# EasyEDA Pro project 16316339.epro, schematic 15F_SCH

## Sheets
1 MOT: Board Name: 15F1D_EDA; Create Date: 2024-05-13; Page Name: MOT; Project Name: 15F1D_EDA; Schematic Name: 15F_SCH; Update Date: 2024-05-16
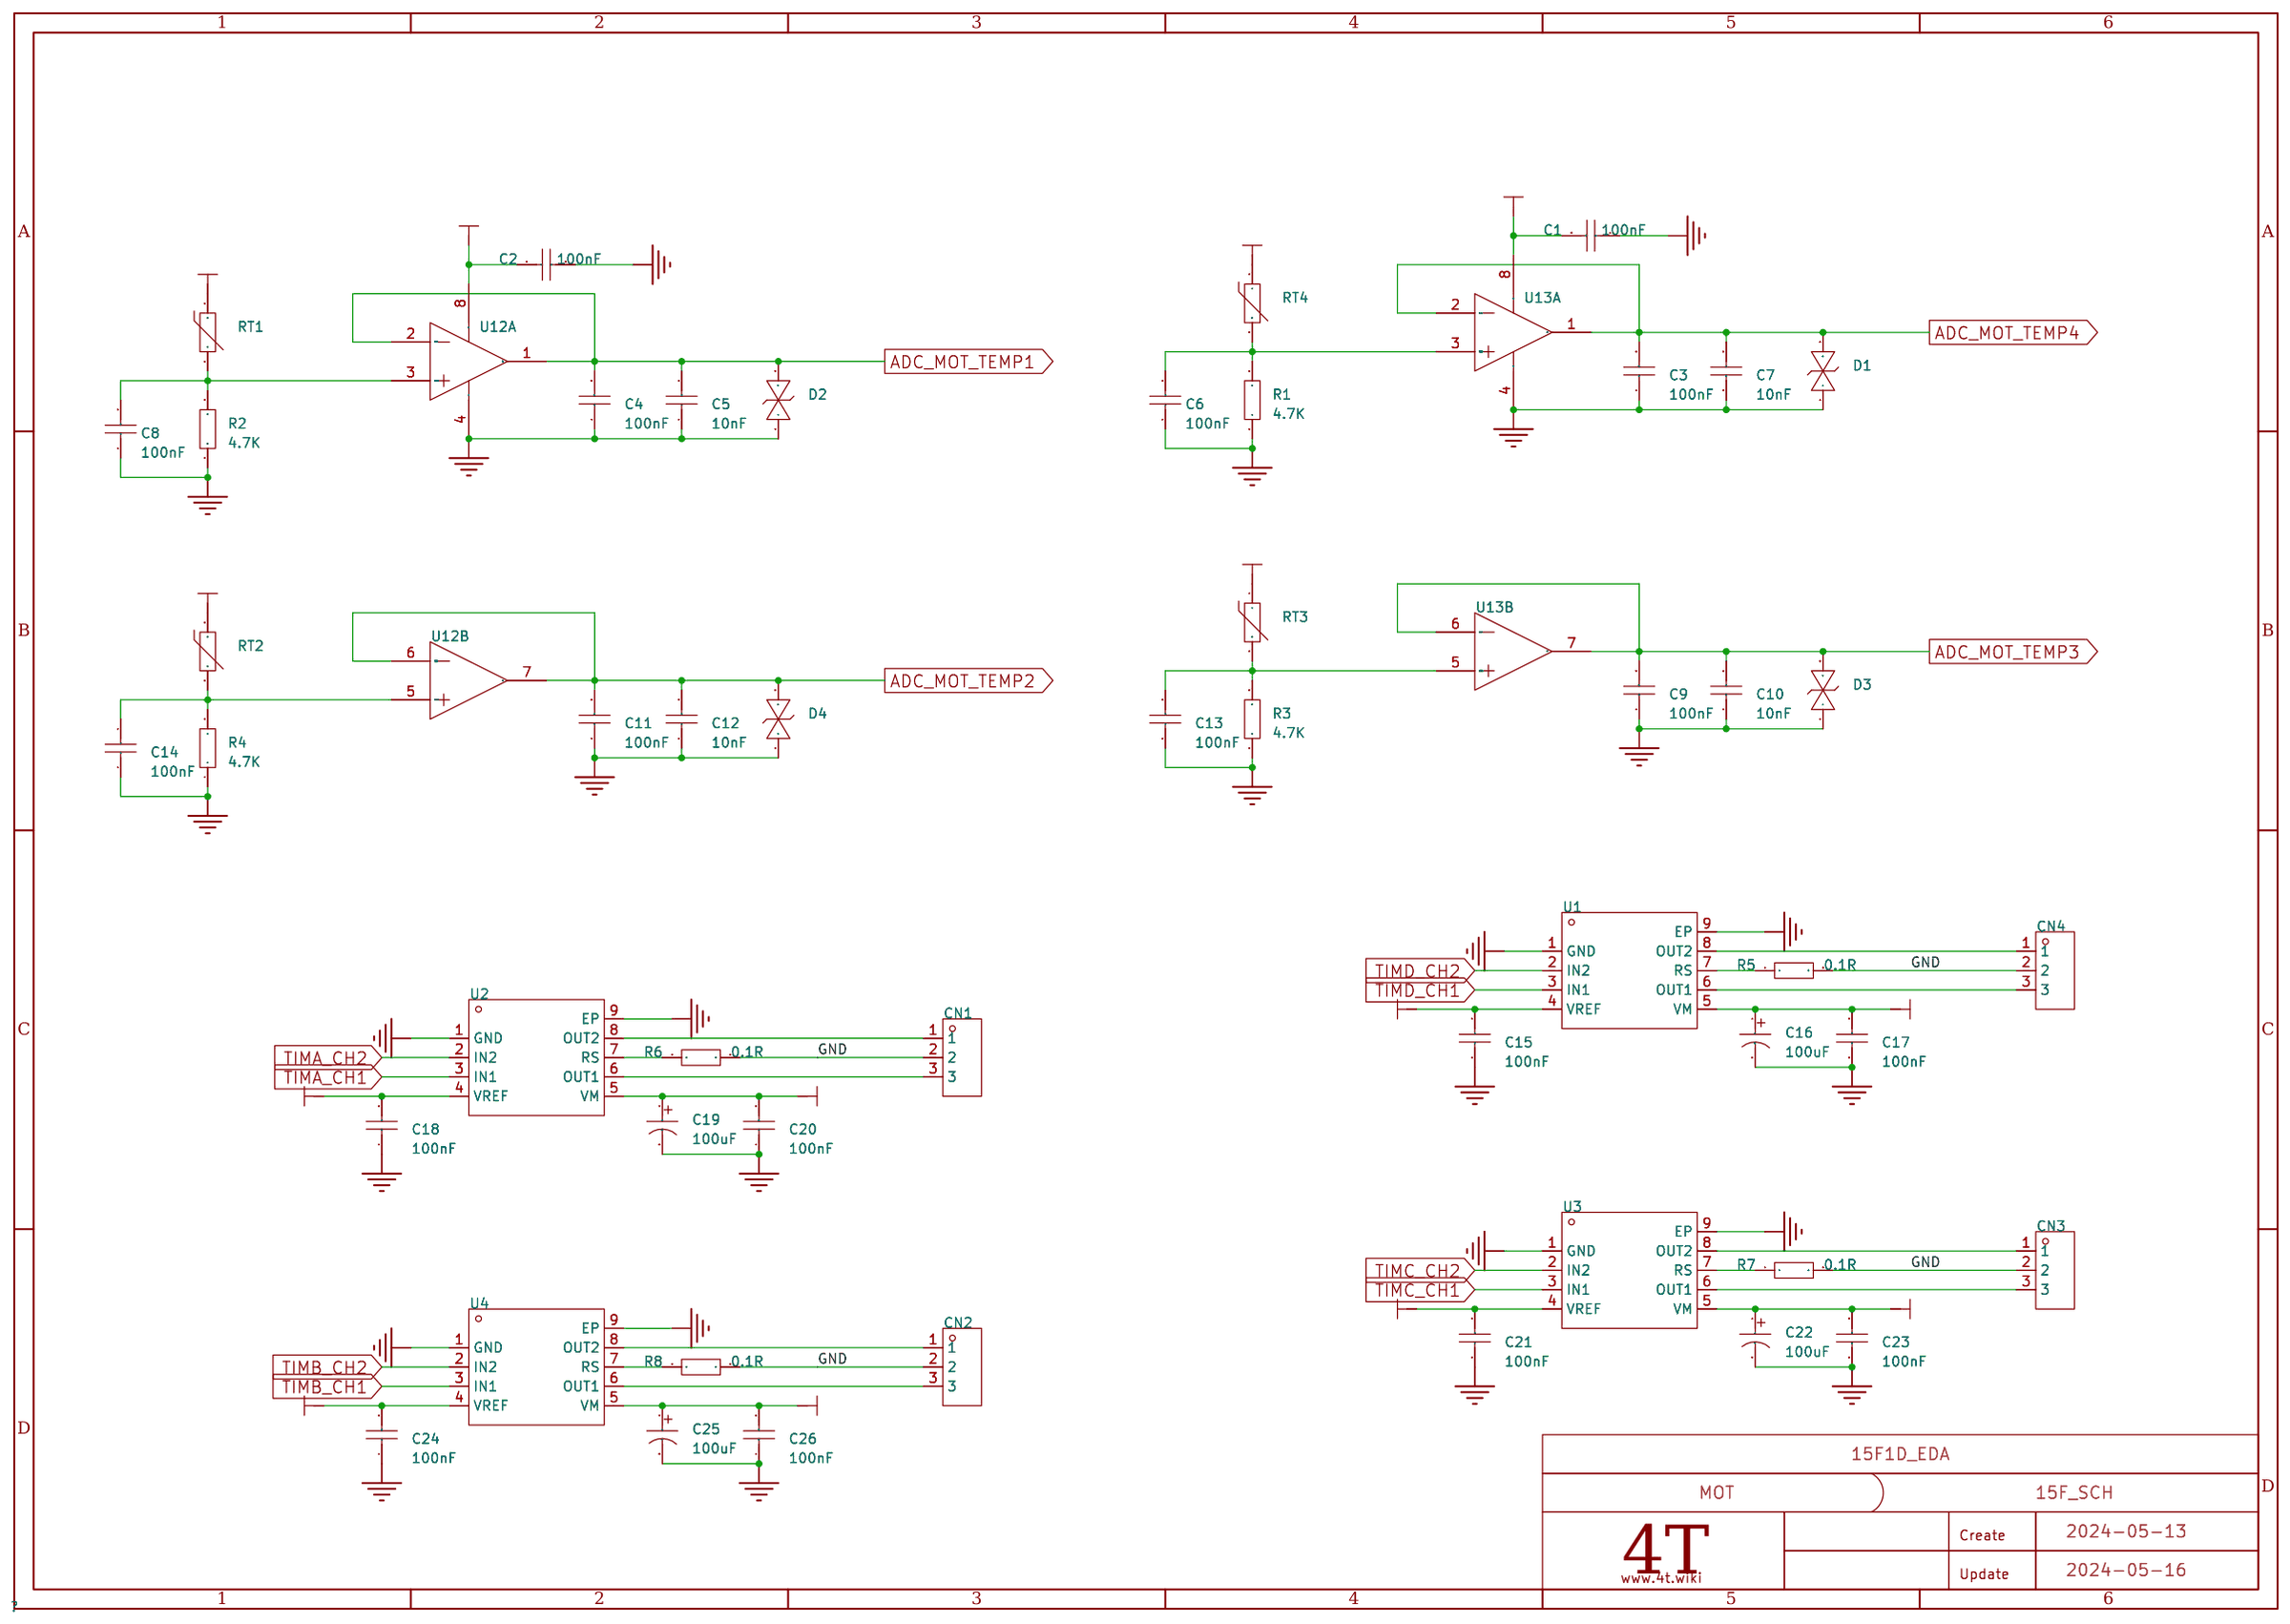
[diagram p0: MOT]
2 COM: Page Name: COM
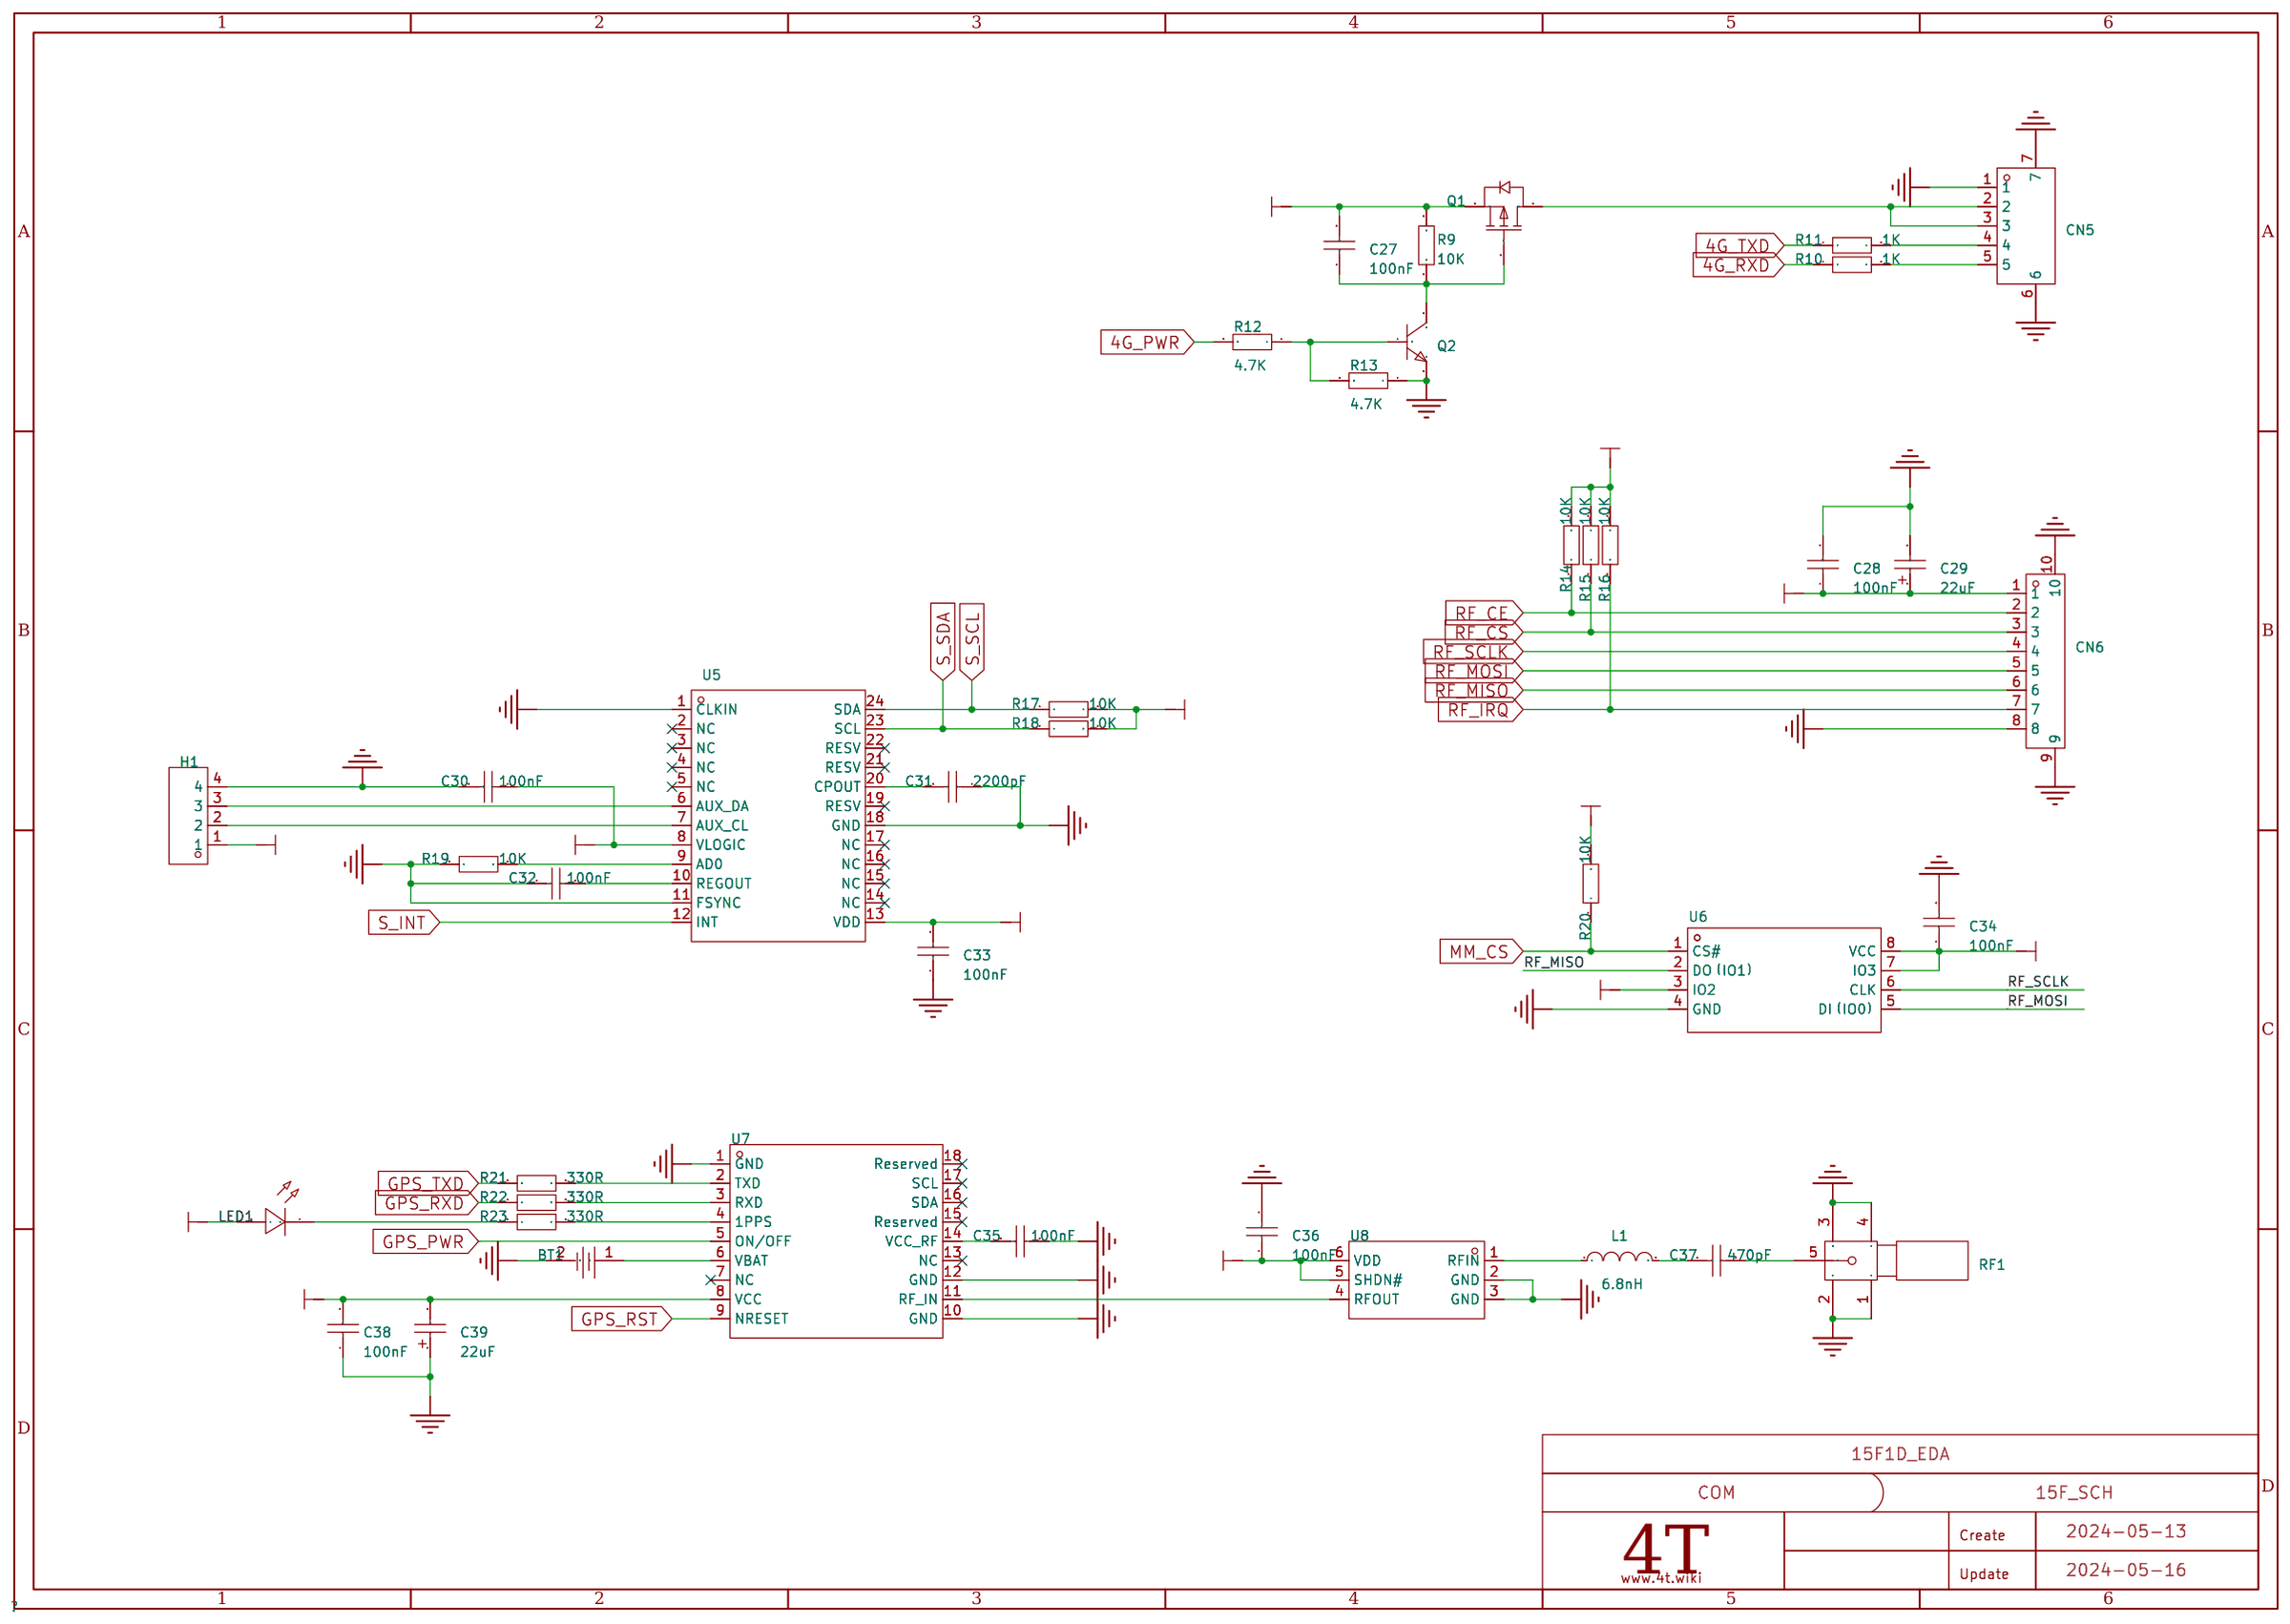
[diagram p1: COM]
3 PWR: Page Name: PWR
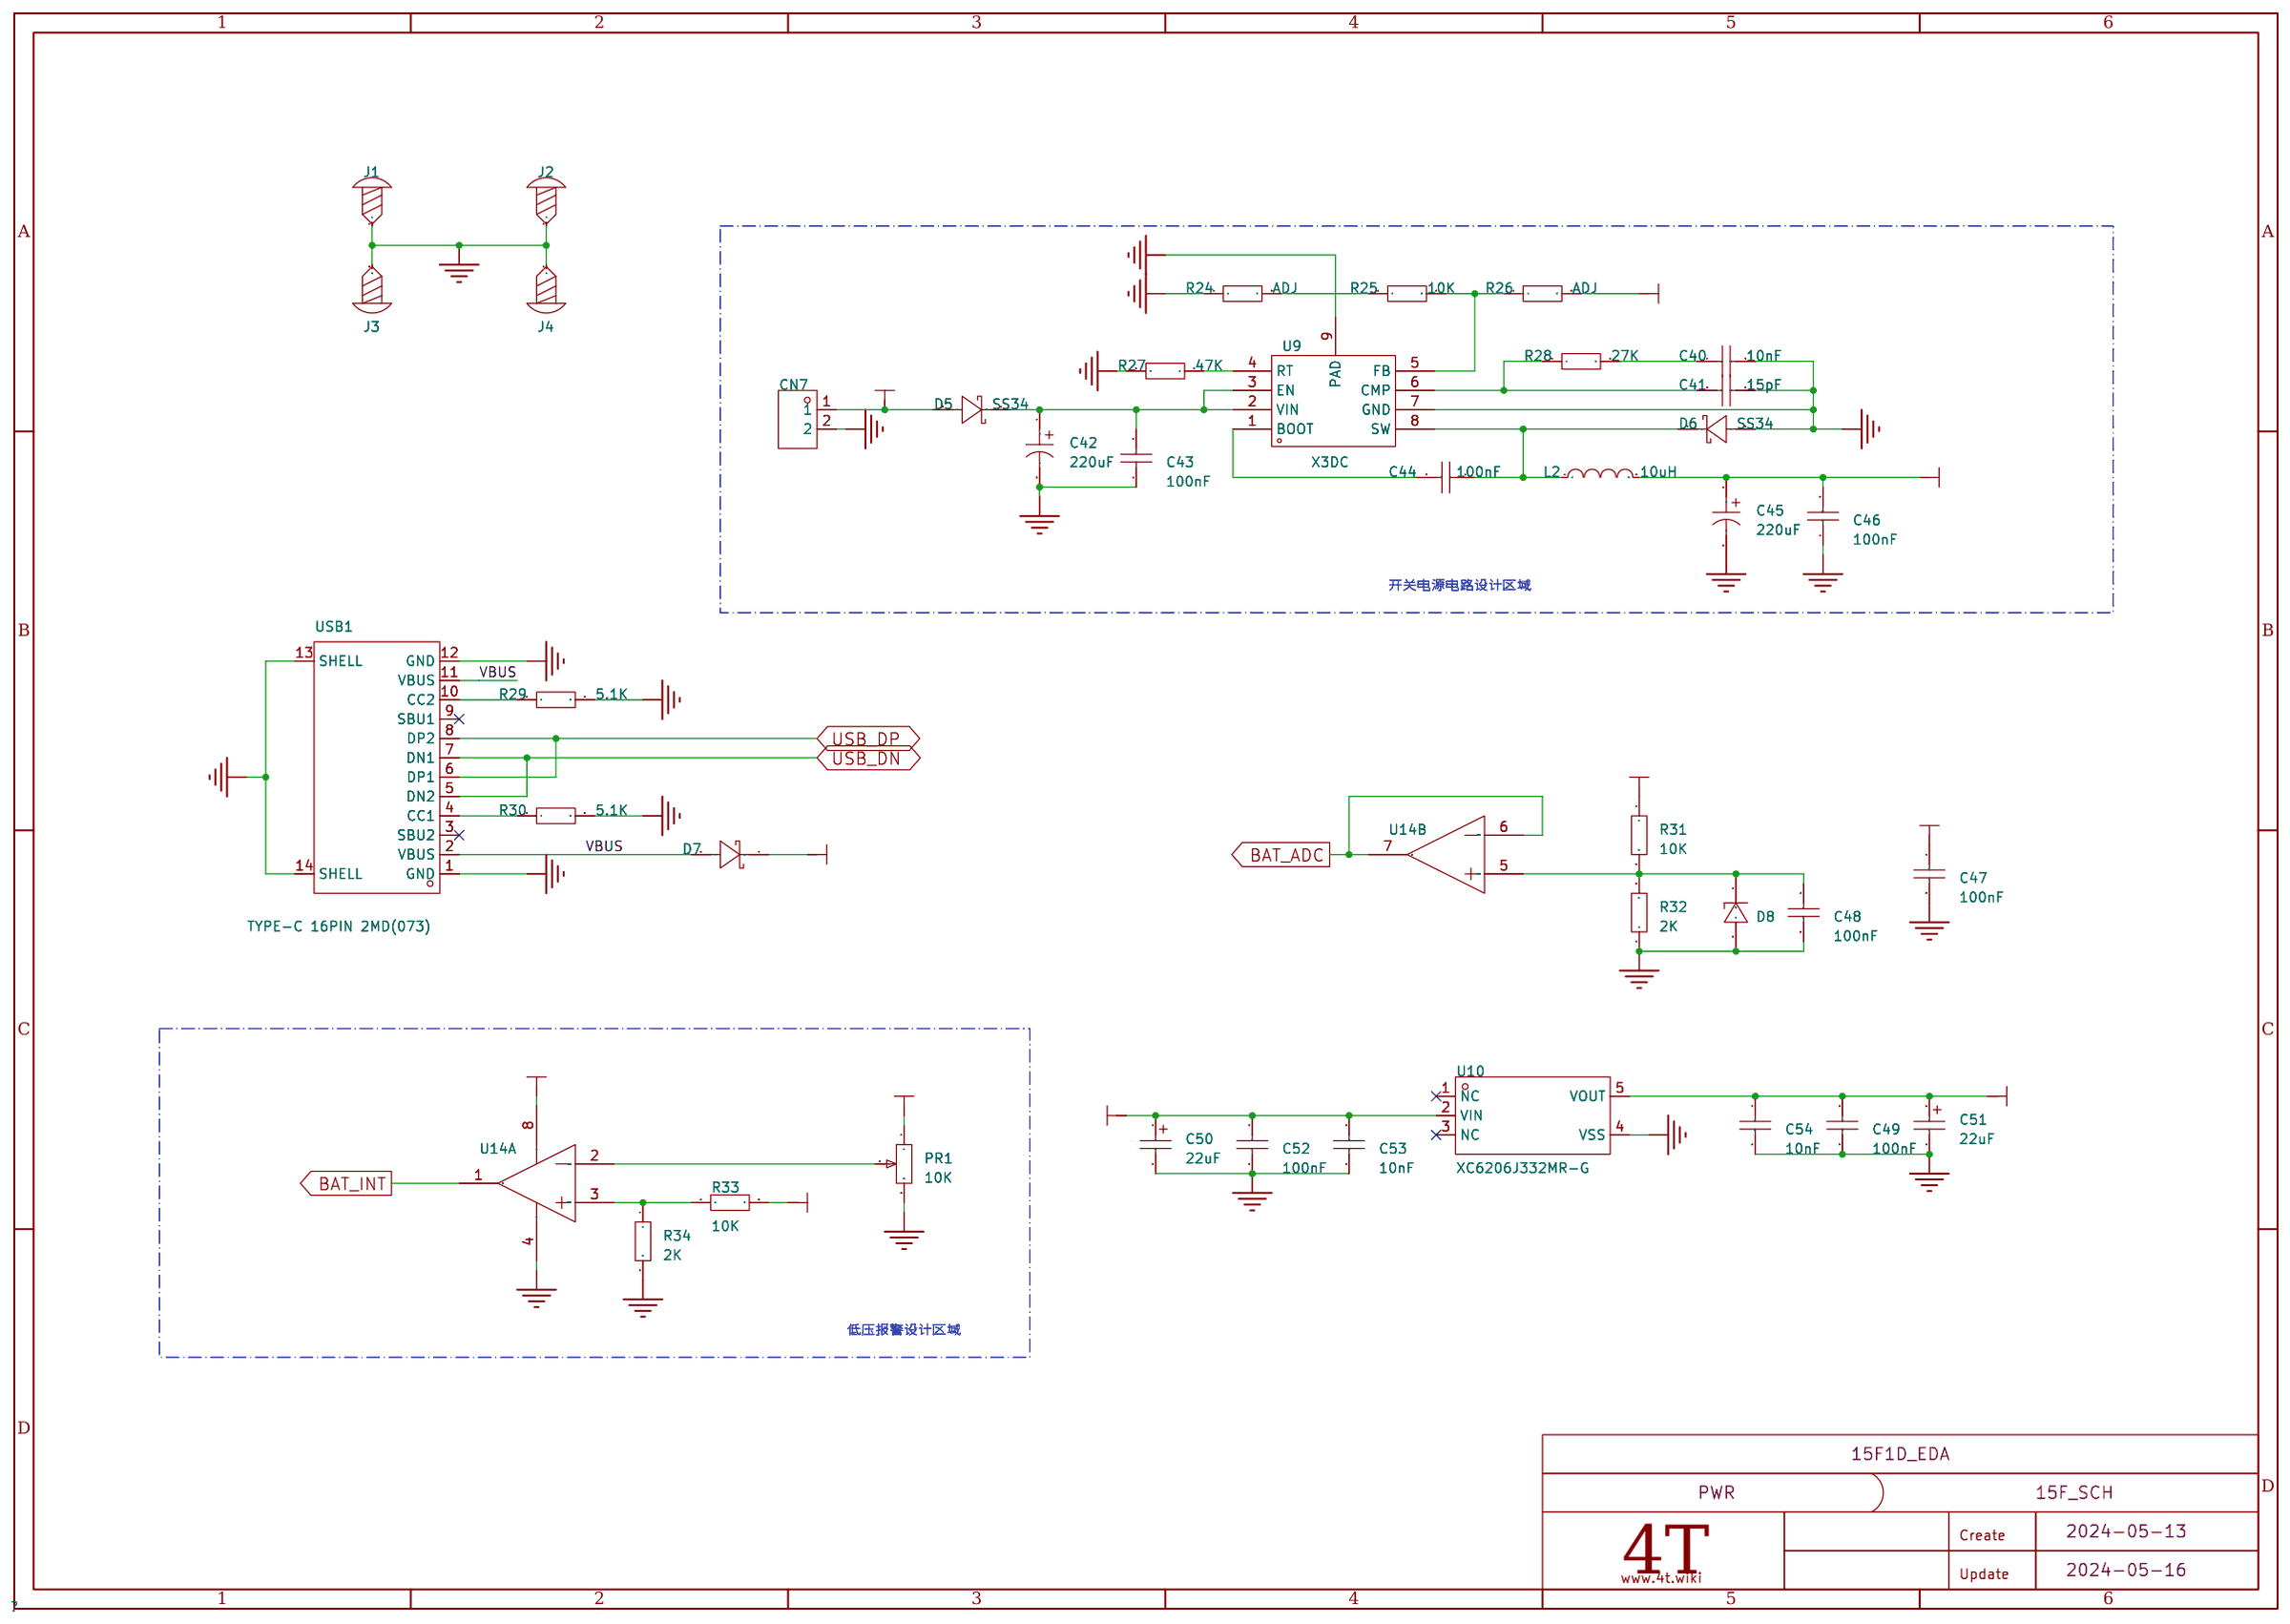
[diagram p2: PWR]
4 MCU: Page Name: MCU
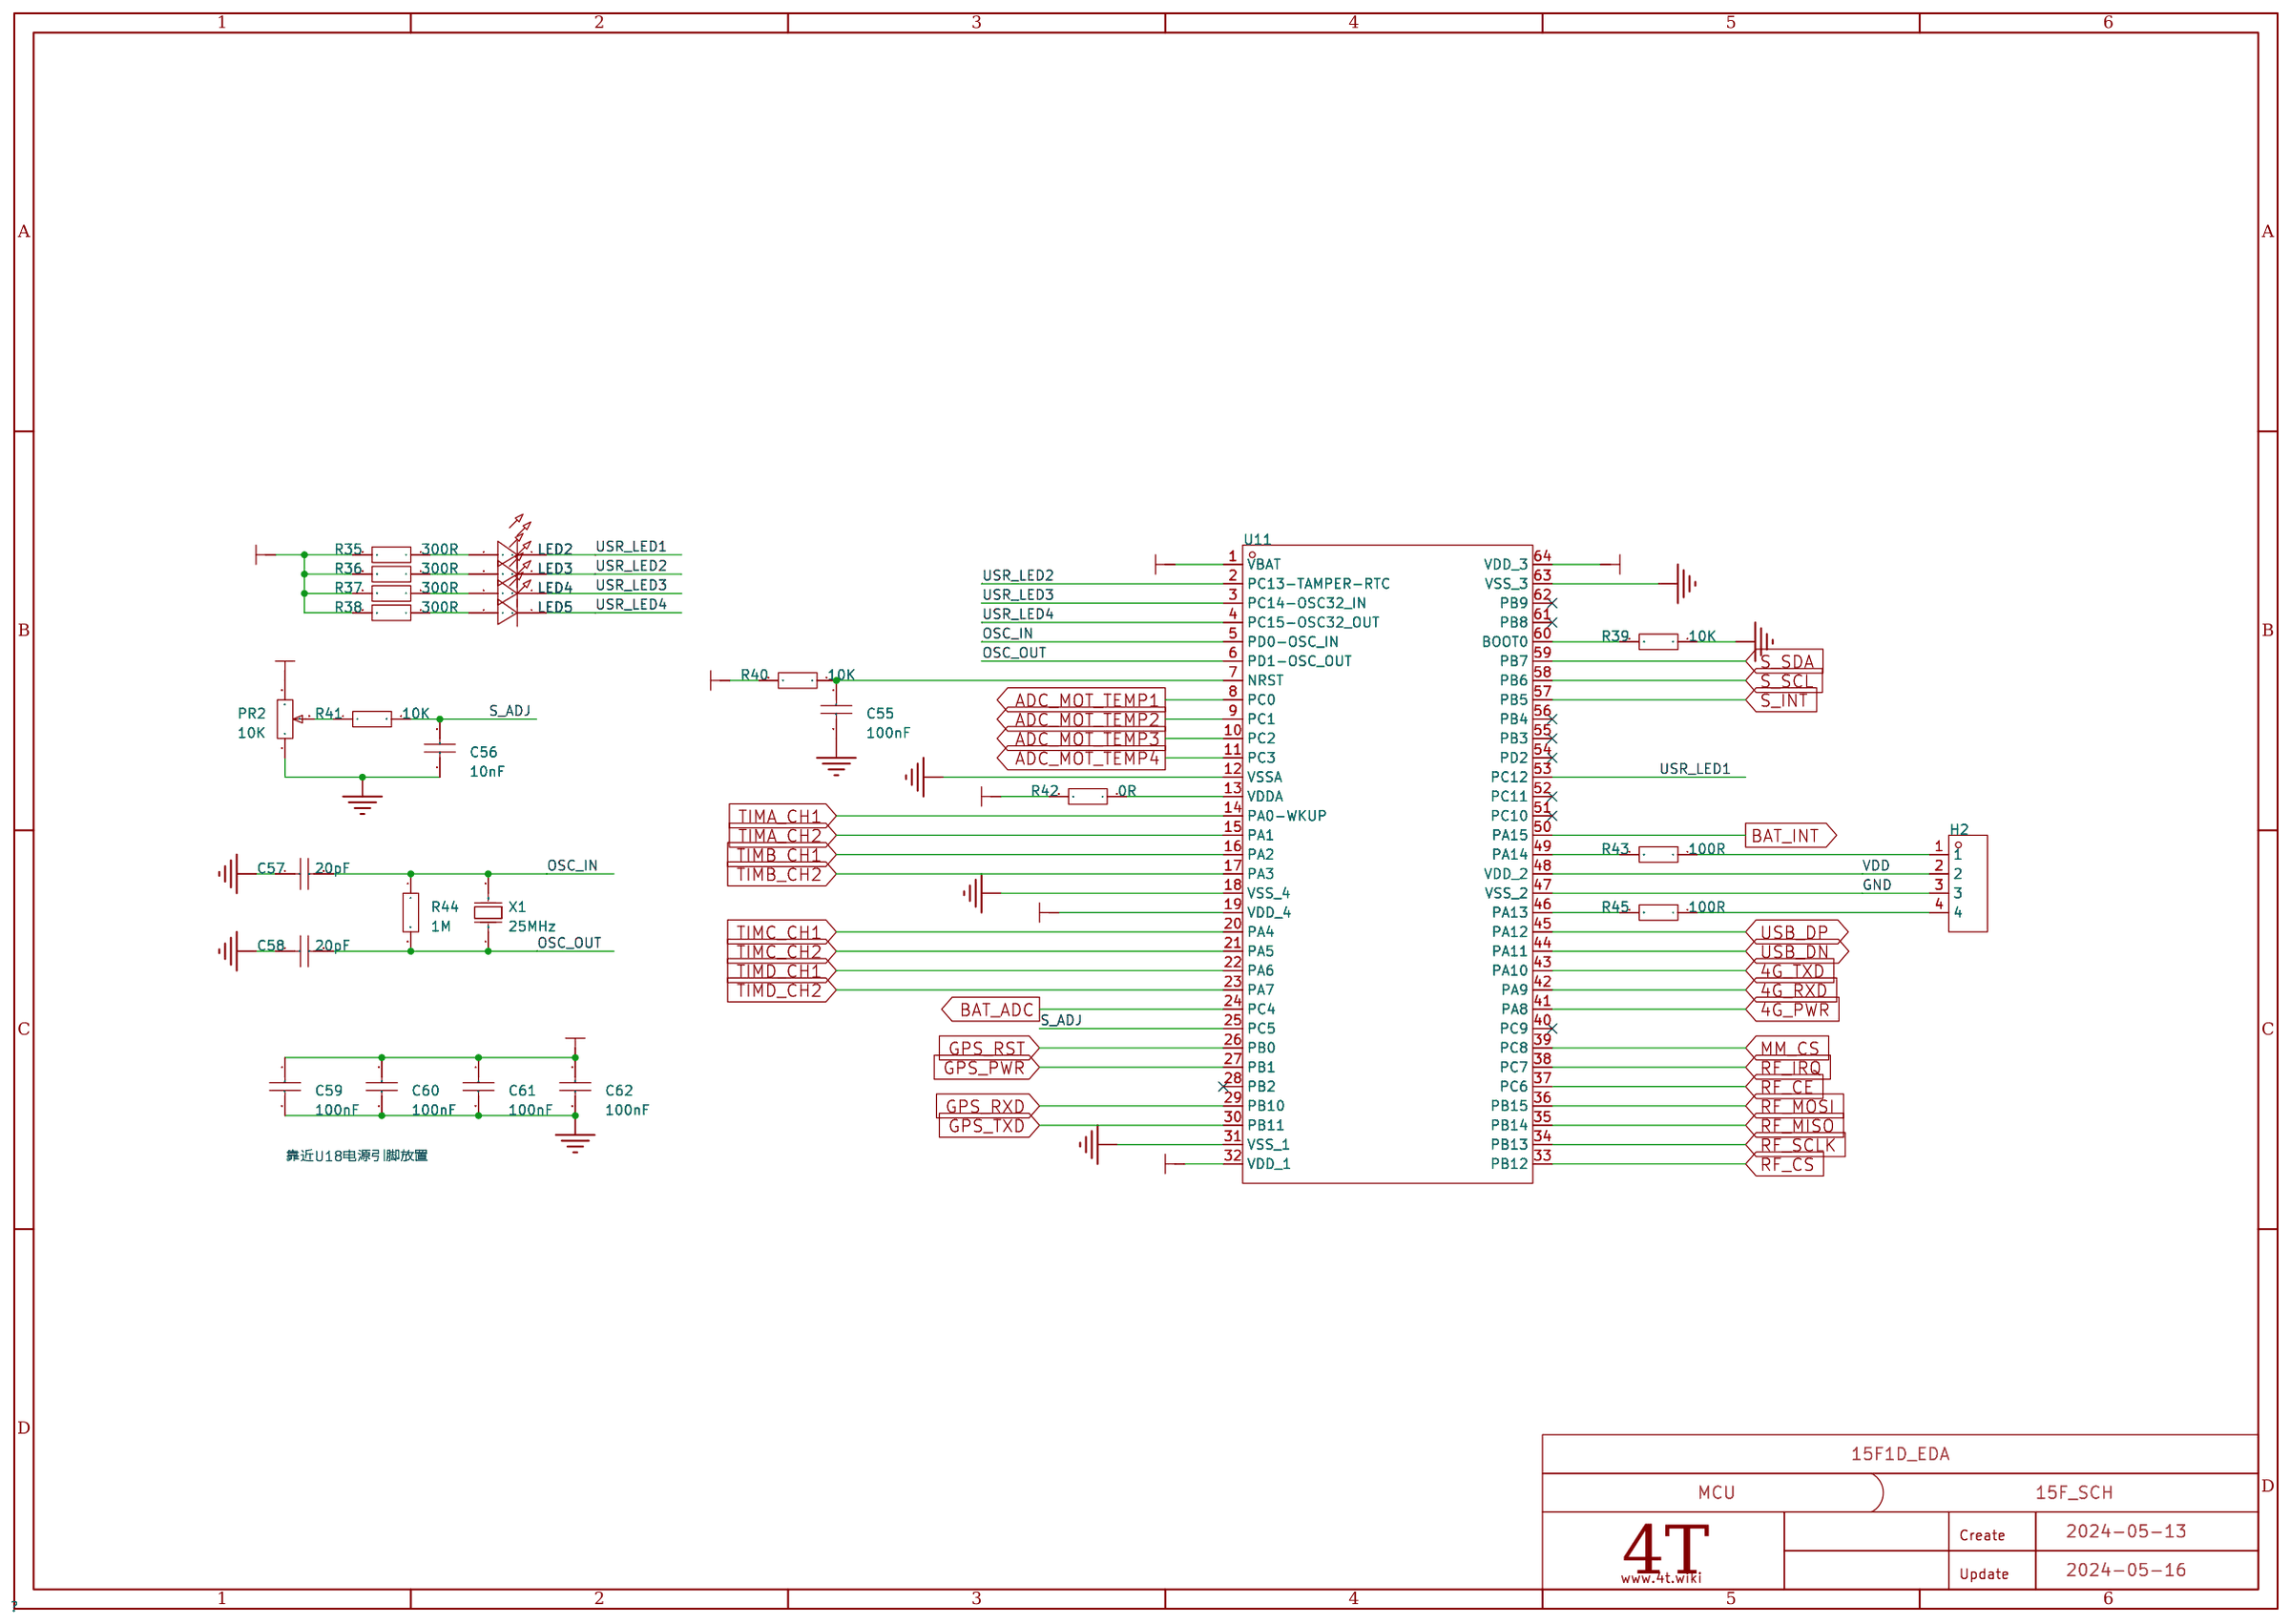
[diagram p3: MCU]

## Parts
sheet COM
BT1  CR1220-A  [BAT-SMD_CR1220-2]
C27  100nF  [C0805]
C28  100nF  [C0805]
C29  22uF  [CASE-A_3216]
C30  100nF  [C0805]
C31  2200pF  [C0805]
C32  100nF  [C0805]
C33  100nF  [C0805]
C34  100nF  [C0805]
C35  100nF  [C0805]
C36  100nF  [C0805]
C37  470pF  [C0805]
C38  100nF  [C0805]
C39  22uF  [CASE-A_3216]
CN5  ZX-XH2.54-5PWT  [CONN-SMD_5P-P2.54_MEGASTAR_ZX-XH2.54-5PWT]
CN6  2.54-8P WT  [CONN-SMD_8P-P2.50_2.54-8P-WT]
H1  -  [HDR-TH_4P-P2.54-V-F]
L1  6.8nH  [L0805]
LED1  -  [LED_0805]
Q1  AO3401A  [SOT-23_L2.9-W1.3-P1.90-LS2.4-BR]
Q2  S8050 J3Y  [SOT-23-3_L3.0-W1.7-P0.95-LS2.9-BR]
R9  10K  [R0805]
R10  1K  [R0805]
R11  1K  [R0805]
R12  4.7K  [R0805]
R13  4.7K  [R0805]
R14  10K  [R0805]
R15  10K  [R0805]
R16  10K  [R0805]
R17  10K  [R0805]
R18  10K  [R0805]
R19  10K  [R0805]
R20  10K  [R0805]
R21  330R  [R0805]
R22  330R  [R0805]
R23  330R  [R0805]
RF1  BWSMA-KWE-Z001  [SMA-TH_BWSMA-KWE-Z001]
U5  MPU6050  [QFN-24_L4.0-W4.0-P0.50-BL]
U6  W25Q32JVSSIQ  [SOIC-8_L5.3-W5.3-P1.27-LS8.0-BL]
U7  ATGM336H-5N31  [GPSM-SMD_ATGM336H-TR]
U8  AT2659S  [SOT-23-6_L2.9-W1.6-P0.95-LS2.8-BR]
sheet MCU
C55  100nF  [C0805]
C56  10nF  [C0805]
C57  20pF  [C0805]
C58  20pF  [C0805]
C59  100nF  [C0805]
C60  100nF  [C0805]
C61  100nF  [C0805]
C62  100nF  [C0805]
H2  -  [HDR-TH_4P-P2.54-V-M]
LED2  -  [LED_0603]
LED3  -  [LED_0603]
LED4  -  [LED_0603]
LED5  -  [LED_0603]
PR2  10K  [R_3386P]
R35  300R  [R0805]
R36  300R  [R0805]
R37  300R  [R0805]
R38  300R  [R0805]
R39  10K  [R0805]
R40  10K  [R0805]
R41  10K  [R0805]
R42  0R  [R0805]
R43  100R  [R0805]
R44  1M  [R0805]
R45  100R  [R0805]
U11  GD32F307RCT6  [LQFP-64_L10.0-W10.0-P0.50-LS12.0-BL]
X1  25MHz  [HC-49S_L11.4-W4.8]
sheet MOT
C1  100nF  [C0805]
C2  100nF  [C0805]
C3  100nF  [C0805]
C4  100nF  [C0805]
C5  10nF  [C0805]
C6  100nF  [C0805]
C7  10nF  [C0805]
C8  100nF  [C0805]
C9  100nF  [C0805]
C10  10nF  [C0805]
C11  100nF  [C0805]
C12  10nF  [C0805]
C13  100nF  [C0805]
C14  100nF  [C0805]
C15  100nF  [C0805]
C16  100uF  [CAP-SMD_BD6.3-L6.6-W6.6-LS7.2-FD]
C17  100nF  [C0805]
C18  100nF  [C0805]
C19  100uF  [CAP-SMD_BD6.3-L6.6-W6.6-LS7.2-FD]
C20  100nF  [C0805]
C21  100nF  [C0805]
C22  100uF  [CAP-SMD_BD6.3-L6.6-W6.6-LS7.2-FD]
C23  100nF  [C0805]
C24  100nF  [C0805]
C25  100uF  [CAP-SMD_BD6.3-L6.6-W6.6-LS7.2-FD]
C26  100nF  [C0805]
CN1  2.54-1*3P  [CONN-TH_C722693]
CN2  2.54-1*3P  [CONN-TH_C722693]
CN3  2.54-1*3P  [CONN-TH_C722693]
CN4  2.54-1*3P  [CONN-TH_C722693]
D1  H3V3LD5B  [SOD-523F_L1.7-W0.9-LS1.7-BI]
D2  H3V3LD5B  [SOD-523F_L1.7-W0.9-LS1.7-BI]
D3  H3V3LD5B  [SOD-523F_L1.7-W0.9-LS1.7-BI]
D4  H3V3LD5B  [SOD-523F_L1.7-W0.9-LS1.7-BI]
R1  4.7K  [R0805]
R2  4.7K  [R0805]
R3  4.7K  [R0805]
R4  4.7K  [R0805]
R5  0.1R  [R0805]
R6  0.1R  [R0805]
R7  0.1R  [R0805]
R8  0.1R  [R0805]
RT1  NTC 5D-7  [RES-TH_L8.5-W5.5-P5.00-D0.6-S5.50]
RT2  NTC 5D-7  [RES-TH_L8.5-W5.5-P5.00-D0.6-S5.50]
RT3  NTC 5D-7  [RES-TH_L8.5-W5.5-P5.00-D0.6-S5.50]
RT4  NTC 5D-7  [RES-TH_L8.5-W5.5-P5.00-D0.6-S5.50]
U1  TB67H450FNG,EL  [HSOP-8_L5.0-W4.0-P1.27-LS6.2-BL-EP]
U2  TB67H450FNG,EL  [HSOP-8_L5.0-W4.0-P1.27-LS6.2-BL-EP]
U3  TB67H450FNG,EL  [HSOP-8_L5.0-W4.0-P1.27-LS6.2-BL-EP]
U4  TB67H450FNG,EL  [HSOP-8_L5.0-W4.0-P1.27-LS6.2-BL-EP]
U12  GS8552-SR  [SOIC-8_L4.9-W3.9-P1.27-LS6.0-BL]  (sections 1,2)
U13  GS8552-SR  [SOIC-8_L4.9-W3.9-P1.27-LS6.0-BL]  (sections 1,2)
sheet PWR
C40  10nF  [C0805]
C41  15pF  [C0805]
C42  220uF  [CAP-SMD_BD8.0-L8.3-W8.3-LS9.3-FD]
C43  100nF  [C0805]
C44  100nF  [C0805]
C45  220uF  [CAP-SMD_BD8.0-L8.3-W8.3-LS9.3-FD]
C46  100nF  [C0805]
C47  100nF  [C0805]
C48  100nF  [C0805]
C49  100nF  [C0805]
C50  22uF  [CASE-A_3216]
C51  22uF  [CASE-A_3216]
C52  100nF  [C0805]
C53  10nF  [C0805]
C54  10nF  [C0805]
CN7  ZX-XH2.54-2PZZ  [CONN-TH_2P-P2.50_HX25003-2A]
D5  SS34  [SMA_L4.3-W2.5-LS5.0-RD]
D6  SS34  [SMA_L4.3-W2.5-LS5.0-RD]
D7  SS34  [SMA_L4.3-W2.5-LS5.0-RD]
D8  BZT52C3V3S  [SOD-323_L1.8-W1.3-LS2.5-RD]
J1  -  [M2螺丝]
J2  -  [M2螺丝]
J3  -  [M2螺丝]
J4  -  [M2螺丝]
L2  10uH  [IND-SMD_L7.3-W6.8]
PR1  10K  [R_3386P]
R24  ADJ  [R0805]
R25  10K  [R0805]
R26  ADJ  [R0805]
R27  47K  [R0805]
R28  27K  [R0805]
R29  5.1K  [R0805]
R30  5.1K  [R0805]
R31  10K  [R0805]
R32  2K  [R0805]
R33  10K  [R0805]
R34  2K  [R0805]
U9  X3DC  [QN_X3DC]
U10  XC6206J332MR-G  [SOT-25_L3.0-W1.6-P0.95-LS2.8-BR]
U14  GS8552-SR  [SOIC-8_L4.9-W3.9-P1.27-LS6.0-BL]  (sections 1,2)
USB1  TYPE-C 16PIN 2MD(073)  [USB-C-SMD_TYPE-C-6PIN-2MD-073]

## Library data of the parts
BT1 = CR1220-A: Supplier Part: C9900016718; Supplier Footprint: SMD-2P; JLCPCB Part Class: 扩展库; Supplier: LCSC
C1-C15 C17 C18 C20 C21 C23 C24 C26-C28 C30-C38 C40 C41 C43 C44 C46-C49 C52-C62 = CC0805KKX7R0BB104: 容值:100nF;精度:±10%;额定电压:100V;材质(温度系数):X7R;; LCSC Part Name: 100nF ±10% 100V; Supplier Part: C106243; Manufacturer: YAGEO(国巨); Supplier Footprint: 0805; Datasheet: https://atta.szlcsc.com/upload/public/pdf/source/20170505/1493951378248.pdf; Supplier: LCSC; Tolerance: ±10%; Voltage Rated: 100V; Temperature Coefficient: X7R
C29 C39 C50 C51 = TAJA226K010RNJ: 容值:22uF;精度:±10%;额定电压:10V;等效串联电阻:3Ω@100kHz;; LCSC Part Name: 22uF ±10% 10V; Supplier Part: C11366; Manufacturer: Kyocera AVX; Supplier Footprint: CASE-A-3216; JLCPCB Part Class: 扩展库; Datasheet: https://atta.szlcsc.com/upload/public/pdf/source/20160107/1457707750344.pdf; Supplier: LCSC; Tolerance: ±10%; Rated Voltage: 10V; Equivalent Series Resistance(ESR): 3Ω@100kHz; Operating Temperature: -55℃~+125℃
CN5 = ZX-XH2.54-5PWT: 插针结构:1x5P;间距:2.54mm;安装方式:卧贴;参考系列:XH;总PIN数:5P;排数:1;每排PIN数:5;行距:-;额定电流:3A;触头材质:黄铜;触头镀层:锡;工作温度范围:-25℃~+85℃;; Supplier Part: C7429674; Manufacturer: Megastar(兆星); Supplier Footprint: SMD,P=2.54mm,卧贴; JLCPCB Part Class: 扩展库; Datasheet: https://atta.szlcsc.com/upload/public/pdf/source/20230619/A4241001BDA461A644BDF6B504C3AF76.pdf; Supplier: LCSC; Pins Structure: 1x5P; Pitch: 2.54mm; Mounting Style: 卧贴; Reference Series: XH; Number of Pins: 5P; Number of Rows: 1; Number of PINs Per Row: 5; Current Rating (Max): 3A; Contact Material: 黄铜; Contact Plating: 锡; Operating Temperature Range: -25℃~+85℃
CN6 = 2.54-8P WT: 插针结构:1x8P;间距:2.54mm;安装方式:卧贴;参考系列:XH;总PIN数:8P;排数:1;每排PIN数:8;额定电流:3A;工作温度范围:-25℃~+85℃;; LCSC Part Name: 间距:2.54mm 1x8P 卧贴; Supplier Part: C5340837; Manufacturer: SHOU HAN(首韩); Supplier Footprint: SMD,P=2.54mm,卧贴; JLCPCB Part Class: 扩展库; Datasheet: https://atta.szlcsc.com/upload/public/pdf/source/20221228/85106BCD9EB86FC8546715D8BC1746BA.pdf; Supplier: LCSC; Pins Structure: 1x8P; Pitch: 2.54mm; Mounting Style: 卧贴; Reference Series: XH; Number of Pins: 8P; Number of Rows: 1; Number of PINs Per Row: 8; Current Rating (Max): 3A; Operating Temperature Range: -25℃~+85℃
H1 = HDR-F_2.54_1x4P: Supplier Part: C2718488; Supplier Footprint: 插件
L1 = BKW0805UC6N8JGT: 电感值:6.8nH;精度:±5%;额定电流:600mA;饱和电流(Isat):-;直流电阻(DCR):110mΩ;; LCSC Part Name: 6.8nH ±5%; Supplier Part: C98541; Manufacturer: FH-BK(风华邦科); Supplier Footprint: 0805; JLCPCB Part Class: 扩展库; Datasheet: https://atta.szlcsc.com/upload/public/pdf/source/20190320/C361661_D11C236CE6FE3C11C97B22D047CD9561.pdf; Supplier: LCSC; Tolerance: ±5%; Rated Current: 600mA; DC Resistance (DCR): 110mΩ
LED1 = LED_0805-G: Supplier Footprint: 0805
Q1 = AO3401A_C15127: 类型:1个P沟道;漏源电压(Vdss):30V;连续漏极电流(Id):4A;功率(Pd):1.4W;导通电阻(RDS(on)@Vgs,Id):44mΩ@10V,4.3A;阈值电压(Vgs(th)@Id):1.3V@250uA;; LCSC Part Name: 1个P沟道 耐压:30V 电流:4A; Supplier Part: C15127; Manufacturer: AOS; Supplier Footprint: SOT-23; JLCPCB Part Class: 基础库; Datasheet: https://atta.szlcsc.com/upload/public/pdf/source/20160507/1462613609053.pdf; Supplier: LCSC; Type: 1个P沟道; Drain Source Voltage (Vdss): 30V; Continuous Drain Current (Id): 4A; Power Dissipation (Pd): 1.4W; Drain Source On Resistance (RDS(on)@Vgs,Id): 44mΩ@10V,4.3A; Gate Threshold Voltage (Vgs(th)@Id): 1.3V@250uA; Total Gate Charge (Qg@Vgs): 12.2nC@4.5V; Input Capacitance (Ciss@Vds): 1.2nF@15V; Operating Temperature: -55℃~+150℃@(Tj)
Q2 = S8050 J3Y_C2146: 晶体管类型:NPN;集电极电流(Ic):500mA;集射极击穿电压(Vceo):25V;功率(Pd):300mW;直流电流增益(hFE@Ic,Vce):200@50mA,1V;; LCSC Part Name: S8050 J3Y(RANGE:200-350) H档(200-350); Supplier Part: C2146; Manufacturer: CJ(江苏长电/长晶); Supplier Footprint: SOT-23; JLCPCB Part Class: 基础库; Datasheet: https://atta.szlcsc.com/upload/public/pdf/source/20140809/1457707209234.pdf; Supplier: LCSC; Transistor Type: NPN; Collector Current (Ic): 500mA; Collector-Emitter Breakdown Voltage (Vceo): 25V; Power Dissipation (Pd): 300mW; DC Current Gain (hFE@Ic,Vce): 200@50mA,1V; Transition Frequency (fT): 150MHz; Collector Cut-Off Current (Icbo): 100nA; Collector-Emitter Saturation Voltage (VCE(sat)@Ic,Ib): 600mV@500mA,50mA
R1-R45 = Res_0805: Supplier Footprint: 0805
RF1 = BWSMA-KWE-Z001: 连接器类型:板端;接口类型:内孔;端口数量:1;接口直径:5.3mm;接口长度/高度:-;频率-最大值:-;射频系列:SMA;阻抗:50Ω;样式:弯头;触头材质:-;触头镀层:-;工作温度范围:-;焊接温度(最大值):-;; LCSC Part Name: 内孔 SMA 弯头; Supplier Part: C496551; Manufacturer: BAT WIRELESS(蝙蝠无线); Supplier Footprint: 插件; JLCPCB Part Class: 扩展库; Datasheet: https://atta.szlcsc.com/upload/public/pdf/source/20231017/997A8C2ADA7F8034A89BE1264F38CE52.pdf; Supplier: LCSC; Connector Type: 板端; Interface Type: 内孔; Number of Ports: 1; Interface Diameter: 5.3mm; RF Series: SMA; Impedance: 50Ω; Style: 弯头
U5 = MPU6050: Supplier Part: C9900042518; Supplier Footprint: QFN-24_L4.0-W4.0-P0.50-BL-EP2.7; Supplier: LCSC
U6 = W25Q32JVSSIQ_C82344: 接口类型:SPI;存储容量:32Mbit;; Supplier Part: C82344; Manufacturer: WINBOND(华邦); Supplier Footprint: SOIC-8-208mil; JLCPCB Part Class: 扩展库; Datasheet: https://atta.szlcsc.com/upload/public/pdf/source/20160910/1473490310454.pdf; Supplier: LCSC; Interface Type: SPI; Memory Size: 32Mbit; Supply Voltage: 2.7V~3.6V; Page Programming Time (Tpp): 3ms; Operating Temperature: -40℃~+85℃
U7 = ATGM336H-5N31: 卫星定位模块 GPS+BDS; LCSC Part Name: BDS/GNSS 全星座定位导航模块; Supplier Part: C90770; Manufacturer: 杭州中科微; Supplier Footprint: SMD,9.7x10.1mm; JLCPCB Part Class: 扩展库; Datasheet: https://atta.szlcsc.com/upload/public/pdf/source/20161226/1482720799860.pdf; Supplier: LCSC
U8 = AT2659S: 电源电压:1.4V~3.6V;供电电流:4.4mA;增益:20dB;P1dB:-15dBm;噪声系数:0.8dB;; LCSC Part Name: L1频段卫星导航射频前端低噪声放大器芯片; Supplier Part: C883443; Manufacturer: 杭州中科微; Supplier Footprint: SOT-23-6; JLCPCB Part Class: 扩展库; Datasheet: https://atta.szlcsc.com/upload/public/pdf/source/20210918/7991F10054B7CD619D693C120CAE9FC9.pdf; Supplier: LCSC; Supply Voltage: 1.4V~3.6V; Supply Current: 4.4mA; Gain: 20dB; P1dB: -15dBm; Noise Figure: 0.8dB; Operating Temperature: -40℃~+85℃
H2 = HDR-M_2.54_1x4P: Supplier Part: C492403; Supplier Footprint: 插件
LED2-LED5 = LED_0603-G: Supplier Footprint: 0603
PR1 PR2 = R_3386P: Supplier Footprint: 直插
U11 = GD32F307RCT6: CPU内核:CM4;程序存储容量:256KB;RAM总容量:96KB;GPIO端口数量:51;工作电压范围:-;CPU最大主频:120MHz;程序存储器类型:FLASH;; Supplier Part: C2959762; Manufacturer: GigaDevice(兆易创新); Supplier Footprint: LQFP-64(10x10); JLCPCB Part Class: 扩展库; Datasheet: https://atta.szlcsc.com/upload/public/pdf/source/20220330/9EB4CC969FC073C66EE3B7E220D59F89.pdf; Supplier: LCSC; CPU Core: CM4; Program Storage Size: 256KB; RAM Size: 96KB; GPIO Ports Number: 51; CPU Maximum Speed: 120MHz; Program Memory Type: FLASH; ADC (Bit): 12bit; DAC (Bit): 12bit; 16Bit Timer: 7; CAN: 2; UART/USART: 5; I2C: 2; I2S: 2; SPI: 3; Universal Serial Bus: 有; Peripheral/Function: 看门狗；以太网协议栈；RTC实时时钟; communication protocol: 以太网协议; Watchdog: 有; Real-Time Clock: 有; Internal Oscillator: 有
X1 = X49SM25MSD2SC: 晶振类型:贴片晶振;频率:25MHz;常温频差:±20ppm;外接负载电容:20pF;频率稳定度(全温):±30ppm;; LCSC Part Name: 25MHz ±20ppm 20pF; Supplier Part: C14872; Manufacturer: YXC(扬兴晶振); Supplier Footprint: HC-49S-SMD; JLCPCB Part Class: 扩展库; Datasheet: https://atta.szlcsc.com/upload/public/pdf/source/20240329/3EBF42EBCAB50CA65B6FA9D7CFA1955A.pdf; Supplier: LCSC; Crystal Type: 贴片晶振; Normal temperature Frequency Tolerance: ±20ppm; External load capacitor: 20pF; Frequency Stability(Full temperature range): ±30ppm; Operating Temperature: -20℃~+70℃
C16 C19 C22 C25 = RVT1C101M0605: 容值:100uF;精度:±20%;额定电压:16V;纹波电流:-;等效串联电阻:-;; LCSC Part Name: 100uF ±20% 16V; Supplier Part: C37308; Manufacturer: HONOR(荣誉); Supplier Footprint: SMD,D6.3xL5.4mm; JLCPCB Part Class: 扩展库; Datasheet: https://atta.szlcsc.com/upload/public/pdf/source/20210521/C113284_25C86AE95FB541053FE695F13EA8E7D0.pdf; Supplier: LCSC; Tolerance: ±20%; Rated Voltage: 16V; φD: 6.3mm; L: 5.4mm; Lifetime @ Temp: 2000hrs@105℃; Operating Temperature: -55℃~+105℃
CN1-CN4 = 2.54-1*3P: 插针结构:1x3P;间距:2.5mm;安装方式:直插;参考系列:-;总PIN数:3P;排数:1;每排PIN数:3;行距:-;额定电流:2A;工作温度范围:-25℃~+85℃;; LCSC Part Name: 1x3P 间距:2.5mm 直插; Supplier Part: C722693; Manufacturer: CAX(创都); Supplier Footprint: 插件,P=2.5mm; JLCPCB Part Class: 扩展库; Datasheet: https://atta.szlcsc.com/upload/public/pdf/source/20200828/C722882_77827A18A6E0E346E9D9EABFEFB0E3A6.pdf; Supplier: LCSC; Pins Structure: 1x3P; Pitch: 2.5mm; Mounting Style: 直插; Number of Pins: 3P; Number of Rows: 1; Number of PINs Per Row: 3; Current Rating (Max): 2A; Operating Temperature Range: -25℃~+85℃
D1-D4 = H3V3LD5B: 极性:双向;反向截止电压(Vrwm):3.3V;最大钳位电压:12V;峰值脉冲电流(Ipp)@10/1000us:8A;峰值脉冲功率(Ppp)@10/1000us:100W;击穿电压:6.5V;; Supplier Part: C20615817; Manufacturer: 宏迦橙; Supplier Footprint: SOD-523; JLCPCB Part Class: Extended Part; Datasheet: https://atta.szlcsc.com/upload/public/pdf/source/20240126/21C8C9739C159483BAB0035C6CA505A8.pdf; Supplier: LCSC; polarity: 双向; Reverse Stand-Off Voltage (Vrwm): 3.3V; Maximum Clamping Voltage: 12V; Peak Pulse Current (Ipp)@10/1000us: 8A; Peak Pulse Power Dissipation (Ppp)@10/1000us: 100W; Breakdown Voltage: 6.5V; Reverse Leakage Current (Ir): 200nA; Operating Temperature: -55℃~+155℃; Type: ESD
RT1-RT4 = NTC 5D-7: 阻值(25℃):5Ω;B值(25℃/50℃):-;电阻精度:-;功率:-;B值精度:-;最大稳态电流(25℃):2A;; LCSC Part Name: 5Ω; Supplier Part: C5385; Manufacturer: RUILON(瑞隆源); Supplier Footprint: 插件,P=5mm; JLCPCB Part Class: 扩展库; Datasheet: https://atta.szlcsc.com/upload/public/pdf/source/20180410/C207392_007A1CB20DB6E487C695D7783FF0F5F9.pdf; Supplier: LCSC; Resistance @ 25℃: 5Ω; Steady State Current (Max): 2A; Operating Temperature: -55℃~+200℃
U1-U4 = TB67H450FNG,EL: 驱动电机类型:有刷直流电机;输出电流:3.5A;; Supplier Part: C545417; Manufacturer: TOSHIBA(东芝); Supplier Footprint: SOIC-8; JLCPCB Part Class: 扩展库; Datasheet: https://atta.szlcsc.com/upload/public/pdf/source/20211227/C3DC112555A020FEF41243C8668D1DC3.pdf; Supplier: LCSC; Drive motor type: 有刷直流电机; Output Current: 3.5A; Operating Temperature: -40℃~+85℃@(Ta)
U12-U14 = GS8552-SR: 放大器数:双路;增益带宽积(GBP):1.8MHz;压摆率(SR):0.95V/us;; Supplier Part: C157716; Manufacturer: Gainsil(聚洵); Supplier Footprint: SOIC-8; JLCPCB Part Class: 扩展库; Datasheet: https://atta.szlcsc.com/upload/public/pdf/source/20200615/C605420_EE0E567F8FF01D919583B114644E1CC3.pdf; Supplier: LCSC; Number of Circuits: 双路; Gain Bandwidth Product(GBP): 1.8MHz; Slew Rate(SR): 0.95V/us; Supply Voltage: 1.8V~5.5V; Supply Current: 180uA; Operating Temperature: -40℃~+125℃
C42 C45 = RVT220UF35V67RV0024: 容值:220uF;精度:±20%;额定电压:35V;纹波电流:195mA@120Hz;等效串联电阻:-;; LCSC Part Name: 220uF ±20% 35V; Supplier Part: C2836441; Manufacturer: KNSCHA(科尼盛); Supplier Footprint: SMD,D8xL10.2mm; JLCPCB Part Class: 扩展库; Datasheet: https://atta.szlcsc.com/upload/public/pdf/source/20210528/C2836441_17B1F737CDEB8BC64E6C288AF923F1CC.pdf; Supplier: LCSC; Tolerance: ±20%; Rated Voltage: 35V; Ripple Current: 195mA@120Hz; φD: 8mm; L: 10.2mm; Lifetime @ Temp: 2000hrs@105℃; Operating Temperature: -55℃~+105℃
CN7 = ZX-XH2.54-2PZZ: 插针结构:1x2P;间距:2.54mm;安装方式:直插;参考系列:XH;总PIN数:2P;排数:1;每排PIN数:2;行距:-;额定电流:3A;触头材质:黄铜;触头镀层:锡;工作温度范围:-25℃~+85℃;; Supplier Part: C7429632; Manufacturer: Megastar(兆星); Supplier Footprint: 插件,P=2.54mm; JLCPCB Part Class: 扩展库; Datasheet: https://atta.szlcsc.com/upload/public/pdf/source/20230619/19BA6947230AA44A04D3EDD65E618FD0.pdf; Supplier: LCSC; Pins Structure: 1x2P; Pitch: 2.54mm; Mounting Style: 直插; Reference Series: XH; Number of Pins: 2P; Number of Rows: 1; Number of PINs Per Row: 2; Current Rating (Max): 3A; Contact Material: 黄铜; Contact Plating: 锡; Operating Temperature Range: -25℃~+85℃
D5-D7 = SS34_C727060: 二极管配置:独立式;正向压降(Vf):550mV@3A;直流反向耐压(Vr):40V;平均整流电流(Io):3A;; LCSC Part Name: 电压:40V 电流:3A; Supplier Part: C727060; Manufacturer: TWGMC(台湾迪嘉); Supplier Footprint: SMA(DO-214AC); JLCPCB Part Class: 扩展库; Datasheet: https://atta.szlcsc.com/upload/public/pdf/source/20200828/C727059_6599B6CAC5F3238B9C33E46794659DBE.pdf; Supplier: LCSC; Diode Configuration: 独立式; Forward Voltage (Vf@If): 550mV@3A; Reverse Voltage (Vr): 40V; Average Rectified Current (Io): 3A; Reverse Leakage Current (Ir): 500uA@40V
D8 = BZT52C3V3S_C545302: 二极管配置:独立式;稳压值(标称值):3.3V;稳压值(范围):3.1V~3.5V;功率:200mW;精度:-;; LCSC Part Name: 齐纳二极管 3.3V 200mW; Supplier Part: C545302; Manufacturer: LGE(鲁光); Supplier Footprint: SOD-323; JLCPCB Part Class: 扩展库; Datasheet: https://atta.szlcsc.com/upload/public/pdf/source/20200521/C545293_B2CADAB6AD6486AFF7E0E8035F83D5C1.pdf; Supplier: LCSC; Diode Configuration: 独立式; Zener Voltage (Nom): 3.3V; Reverse Leakage Current (Ir): 5uA@1V; Zener Voltage (Range): 3.1V~3.5V; Power Dissipation: 200mW; Zener Impedance (Zzt): 95Ω
J1-J4 = M2螺丝: Supplier Footprint: 插件
L2 = FXL0630-100-M: 电感值:10uH;精度:±20%;额定电流:4.5A;饱和电流(Isat):5.5A;类型:一体成型电感;; LCSC Part Name: 10uH ±20% 5.5A; Supplier Part: C167223; Manufacturer: cjiang(长江微电); Supplier Footprint: SMD,6.6x7mm; JLCPCB Part Class: 扩展库; Datasheet: https://atta.szlcsc.com/upload/public/pdf/source/20230516/3A080F5AF8C87BB81C3BA86E5F60E51A.pdf; Supplier: LCSC; Tolerance: ±20%; Rated Current: 4.5A; Saturation Current (Isat): 5.5A; DC Resistance (DCR): 68mΩ; Type: 一体成型电感
U9 = X3DC
U10 = XC6206J332MR-G: 输出类型:固定;最大输入电压:6V;输出电压:3.3V;最大输出电流:200mA;电源纹波抑制比(PSRR):-;输出极性:正极;; LCSC Part Name: 输入6V 输出3.3V 200mA; Supplier Part: C155728; Manufacturer: TOREX(特瑞仕); Supplier Footprint: SOT-25; JLCPCB Part Class: 扩展库; Datasheet: https://atta.szlcsc.com/upload/public/pdf/source/20171221/C155730_15138396580711196064.pdf; Supplier: LCSC; Output Type: 固定; Maximum Input Voltage: 6V; Output Voltage: 3.3V; MAX Output Current: 200mA; Dropout Voltage: 320mV@(100mA); Output Polarity: 正极; Number of Outputs: 1
USB1 = TYPE-C 16PIN 2MD(073): 连接器类型:Type-C;标准:-;公母:母;端口数量:1;触点数量:16P;安装方式:卧贴;额定电流 - 电源:5A;工作温度范围:-25℃~+85℃;; LCSC Part Name: Type-C 母 卧贴; Supplier Part: C2765186; Manufacturer: SHOU HAN(首韩); Supplier Footprint: SMD; JLCPCB Part Class: 扩展库; Datasheet: https://atta.szlcsc.com/upload/public/pdf/source/20211123/39B17C16241EAC15C5E277BDA434118E.pdf; Supplier: LCSC; Connector Type: Type-C; Gender: 母; Number of Ports: 1; Number of Contacts: 16P; Mounting Style: 卧贴; Current Rating - Power (Max): 5A; Operating Temperature Range: -25℃~+85℃

## Nets
+5V0: C27.2 C45.1 C46.2 C50.1 C52.1 C53.1 D7.1(C) L2.2 Q1.2(S) R9.2 R26.2 U10.2(VIN)
GND: BT1.2 C1.1 C2.1 C3.1 C4.1 C5.1 C6.1 C7.1 C8.1 C9.1 C10.1 C11.1 C12.1 C13.1 C14.1 C15.1 C16.2 C17.1 C18.1 C19.2 C20.1 C21.1 C22.2 C23.1 C24.1 C25.2 C26.1 C28.2 C29.2 C30.2 C31.1 C32.2 C33.1 C34.2 C35.1 C36.2 C38.1 C39.1 C40.2 C41.1 C42.2 C43.2 C45.2 C46.1 C47.2 C48.2 C49.2 C50.2 C51.2 C52.2 C53.2 C54.2 C55.2 C56.1 C57.1 C58.1 C59.2 C60.2 C61.2 C62.2 CN1.2 CN2.2 CN3.2 CN4.2 CN5.1 CN5.6 CN5.7 CN6.8 CN6.9 CN6.10 CN7.2 D1.1 D2.1 D3.1 D4.1 D6.2(A) D8.2(A) H1.4 H2.3 J1.1 J2.1 J3.1 J4.1 PR1.3 PR2.1 Q2.2(E) R1.1 R2.1 R3.1 R4.1 R5.2 R6.2 R7.2 R8.2 R13.1 R19.1 R24.1 R27.2 R29.2 R30.2 R32.1 R34.2 R39.1 RF1.1 RF1.2 RF1.3 RF1.4 U1.1(GND) U1.9(EP) U2.1(GND) U2.9(EP) U3.1(GND) U3.9(EP) U4.1(GND) U4.9(EP) U5.1(CLKIN) U5.11(FSYNC) U5.18(GND) U6.4(GND) U7.1(GND) U7.10(GND) U7.12(GND) U8.2(GND) U8.3(GND) U9.7(GND) U9.9(PAD) U10.4(VSS) U11.12(VSSA) U11.18(VSS_4) U11.31(VSS_1) U11.47(VSS_2) U11.63(VSS_3) U12.4(-V) U13.4(-V) U14.4(-V) USB1.1(GND) USB1.12(GND) USB1.13(SHELL) USB1.14(SHELL)
VBAT: C16.1 C17.2 C19.1 C20.2 C22.1 C23.2 C25.1 C26.2 CN7.1 D5.2(A) R31.1 R33.2 U1.5(VM) U2.5(VM) U3.5(VM) U4.5(VM)
VBUS: D7.2(A) USB1.2(VBUS) USB1.11(VBUS)
VDD: C1.2 C2.2 C15.2 C18.2 C21.2 C24.2 C28.1 C29.1 C30.1 C33.2 C34.1 C36.1 C38.2 C39.2 C47.1 C49.1 C51.1 C54.1 C59.1 C60.1 C61.1 C62.1 CN6.1 H1.1 H2.2 LED1.2(A) PR1.1 PR2.3 R14.2 R15.2 R16.2 R17.2 R18.2 R20.2 R35.2 R36.2 R37.2 R38.2 R40.2 R42.2 RT1.1 RT2.1 RT3.1 RT4.1 U1.4(VREF) U2.4(VREF) U3.4(VREF) U4.4(VREF) U5.8(VLOGIC) U5.13(VDD) U6.3(IO2) U6.7(IO3) U6.8(VCC) U7.8(VCC) U8.5(SHDN#) U8.6(VDD) U10.5(VOUT) U11.1(VBAT) U11.19(VDD_4) U11.32(VDD_1) U11.48(VDD_2) U11.64(VDD_3) U12.8(+V) U13.8(+V) U14.8(+V)
4G_PWR: R12.2 U11.41(PA8)
4G_RXD: R10.1 U11.42(PA9)
4G_TXD: R11.1 U11.43(PA10)
ADC_MOT_TEMP1: C4.2 C5.2 D2.2 U11.8(PC0) U12.1(OUT) U12.2(INVERTING INPUT)
ADC_MOT_TEMP2: C11.2 C12.2 D4.2 U11.9(PC1) U12.6(INVERTING INPUT) U12.7(OUT)
ADC_MOT_TEMP3: C9.2 C10.2 D3.2 U11.10(PC2) U13.6(INVERTING INPUT) U13.7(OUT)
ADC_MOT_TEMP4: C3.2 C7.2 D1.2 U11.11(PC3) U13.1(OUT) U13.2(INVERTING INPUT)
BAT_ADC: U11.24(PC4) U14.6(INVERTING INPUT) U14.7(OUT)
BAT_INT: U11.50(PA15) U14.1(OUT)
GPS_PWR: U7.5(ON/OFF) U11.27(PB1)
GPS_RST: U7.9(NRESET) U11.26(PB0)
GPS_RXD: R22.1 U11.29(PB10)
GPS_TXD: R21.1 U11.30(PB11)
MM_CS: R20.1 U6.1(CS#) U11.39(PC8)
OSC_IN: C57.2 R44.1 U11.5(PD0-OSC_IN) X1.2(OSC2)
OSC_OUT: C58.2 R44.2 U11.6(PD1-OSC_OUT) X1.1(OSC1)
RF_CE: CN6.2 R14.1 U11.37(PC6)
RF_CS: CN6.3 R15.1 U11.33(PB12)
RF_IRQ: CN6.7 R16.1 U11.38(PC7)
RF_MISO: CN6.6 U6.2(DO（IO1）) U11.35(PB14)
RF_MOSI: CN6.5 U6.5(DI（IO0）) U11.36(PB15)
RF_SCLK: CN6.4 U6.6(CLK) U11.34(PB13)
S_ADJ: C56.2 R41.2 U11.25(PC5)
S_INT: U5.12(INT) U11.57(PB5)
S_SCL: R17.1 U5.24(SDA) U11.58(PB6)
S_SDA: R18.1 U5.23(SCL) U11.59(PB7)
TIMA_CH1: U2.3(IN1) U11.14(PA0-WKUP)
TIMA_CH2: U2.2(IN2) U11.15(PA1)
TIMB_CH1: U4.3(IN1) U11.16(PA2)
TIMB_CH2: U4.2(IN2) U11.17(PA3)
TIMC_CH1: U3.3(IN1) U11.20(PA4)
TIMC_CH2: U3.2(IN2) U11.21(PA5)
TIMD_CH1: U1.3(IN1) U11.22(PA6)
TIMD_CH2: U1.2(IN2) U11.23(PA7)
USB_DN: U11.44(PA11) USB1.5(DN2) USB1.7(DN1)
USB_DP: U11.45(PA12) USB1.6(DP1) USB1.8(DP2)
USR_LED1: LED2.1(C) U11.53(PC12)
USR_LED2: LED3.1(C) U11.2(PC13-TAMPER-RTC)
USR_LED3: LED4.1(C) U11.3(PC14-OSC32_IN)
USR_LED4: LED5.1(C) U11.4(PC15-OSC32_OUT)
$1N2668: C8.2 R2.2 RT1.2 U12.3(NONINVERTING INPUT)
$1N3435: C14.2 R4.2 RT2.2 U12.5(NONINVERTING INPUT)
$1N4661: C6.2 R1.2 RT4.2 U13.3(NONINVERTING INPUT)
$1N4689: C13.2 R3.2 RT3.2 U13.5(NONINVERTING INPUT)
$1N12389: R6.1 U2.7(RS)
$1N12395: CN1.1 U2.8(OUT2)
$1N12398: CN1.3 U2.6(OUT1)
$1N13149: R8.1 U4.7(RS)
$1N13151: CN2.1 U4.8(OUT2)
$1N13153: CN2.3 U4.6(OUT1)
$1N13495: R5.1 U1.7(RS)
$1N13497: CN4.1 U1.8(OUT2)
$1N13499: CN4.3 U1.6(OUT1)
$1N13841: R7.1 U3.7(RS)
$1N13843: CN3.1 U3.8(OUT2)
$1N13845: CN3.3 U3.6(OUT1)
$2N966: U7.11(RF_IN) U8.4(RFOUT)
$2N1017: L1.1 U8.1(RFIN)
$2N1310: C37.2 L1.2
$2N1635: C37.1 RF1.5
$2N1762: C35.2 U7.14(VCC_RF)
$2N1963: BT1.1 U7.6(VBAT)
$2N2085: R21.2 U7.2(TXD)
$2N2141: R22.2 U7.3(RXD)
$2N2347: R23.2 U7.4(1PPS)
$2N2350: LED1.1(C) R23.1
$2N3257: R19.2 U5.9(AD0)
$2N3275: C32.1 U5.10(REGOUT)
$2N3619: C31.2 U5.20(CPOUT)
$2N3742: H1.3 U5.6(AUX_DA)
$2N3752: H1.2 U5.7(AUX_CL)
$2N4604: CN5.4 R11.2
$2N4608: CN5.5 R10.2
$2N4932: CN5.2 CN5.3 Q1.3(D)
$2N5169: Q2.1(B) R12.1 R13.2
$2N5247: C27.1 Q1.1(G) Q2.3(C) R9.1
$3N4980: R29.1 USB1.10(CC2)
$3N4986: R30.1 USB1.4(CC1)
$3N6297: C48.1 D8.1(C) R31.2 R32.2 U14.5(NONINVERTING INPUT)
$3N44657: C42.1 C43.1 D5.1(C) U9.2(VIN) U9.3(EN)
$3N44801: R27.1 U9.4(RT)
$3N44806: C40.1 R28.2
$3N44813: C41.2 R28.1 U9.6(CMP)
$3N44886: C44.1 D6.1(C) L2.1 U9.8(SW)
$3N44904: C44.2 U9.1(BOOT)
$3N44930: R25.2 R26.1 U9.5(FB)
$3N44946: R24.2 R25.1
$3N45005: R33.1 R34.1 U14.3(NONINVERTING INPUT)
$3N45031: PR1.2 U14.2(INVERTING INPUT)
$4N1687: R42.1 U11.13(VDDA)
$4N1976: C55.1 R40.1 U11.7(NRST)
$4N3396: R43.2 U11.49(PA14)
$4N3397: H2.1 R43.1
$4N3426: R45.2 U11.46(PA13)
$4N3427: H2.4 R45.1
$4N3881: PR2.2 R41.1
$4N4060: R39.2 U11.60(BOOT0)
$4N4288: LED2.2(A) R35.1
$4N4290: LED3.2(A) R36.1
$4N4292: LED4.2(A) R37.1
$4N4294: LED5.2(A) R38.1

Not connected (* = marked no-connect by the designer): U5 2(NC)* 3(NC)* 4(NC)* 5(NC)* 14(NC)* 15(NC)* 16(NC)* 17(NC)* 19(RESV)* 21(RESV)* 22(RESV)*; U7 7(NC)* 13(NC)* 15(Reserved)* 16(SDA)* 17(SCL)* 18(Reserved)*; U10 1(NC)* 3(NC)*; U11 28(PB2)* 40(PC9)* 51(PC10)* 52(PC11)* 54(PD2)* 55(PB3)* 56(PB4)* 61(PB8)* 62(PB9)*; USB1 3(SBU2)* 9(SBU1)*

## Notes on the sheets
sheet 3
- 开关电源电路设计区域
- 低压报警设计区域
sheet 4
- 靠近U18电源引脚放置
